# EAGLE design caphumidsens2_rev1_rc1 (EAGLE 6.3)
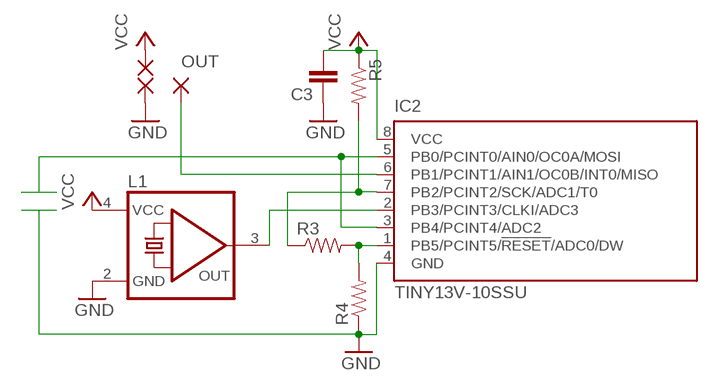
[diagram p0: schematic, sheet 1]

## Parts
C3  CAP0805  [0805]
GND  WIREPADSMD2,54-5,08  SMD2  [SMD1,27-2,54]
IC2  TINY13V-10SSU  [8S1]
L1  XO32-OSCILLATOR  [XO32]
OUT  WIREPADSMD2,54-5,08  SMD2  [SMD1,27-2,54]
R3  RESISTOR0805-RES  [0805]
R4  RESISTOR0805-RES  [0805]
R5  RESISTOR0805-RES  [0805]
VCC  WIREPADSMD2,54-5,08  SMD2  [SMD1,27-2,54]

## Nets
1_3RD_VCC: IC2.1(PB5/PCINT5/!RESET!/ADC0/DW) R3.2 R4.2
2_3RD_VCC: IC2.7(PB2/PCINT2/SCK/ADC1/T0) R3.1 R5.2
CAP+: IC2.3(PB4/PCINT4/ADC2) IC2.5(PB0/PCINT0/AIN0/OC0A/MOSI)
GND: C3.1 GND.1(P) IC2.4(GND) L1.2(GND) R4.1
OSC: IC2.2(PB3/PCINT3/CLKI/ADC3) L1.3(OUT)
OUT: IC2.6(PB1/PCINT1/AIN1/OC0B/INT0/MISO) OUT.1(P)
VCC: C3.2 IC2.8(VCC) L1.4(VCC) R5.1 VCC.1(P)

## Library data of the parts
C3 = SparkFun:CAP: Capacitor Standard 0603 ceramic capacitor, and 0.1" leaded capacitor.
GND OUT VCC = wirepad:SMD2: SMD PAD
IC2 = atmel:TINY13: 8-bit AVR Microcontroller with 1K Bytes In-System Programmable Flash Source: http://www.atmel.com/dyn/resources/prod_documents/2535S.pdf; MPN: ATTINY13V-10SSU; OC_FARNELL: 1455135; OC_NEWARK: 58M3773
L1 = seb:XO32-OSCILLATOR
R3-R5 = SparkFun:RESISTOR: Resistor Basic schematic elements and footprints for 0603, 1206, and PTH resistors.

## Board
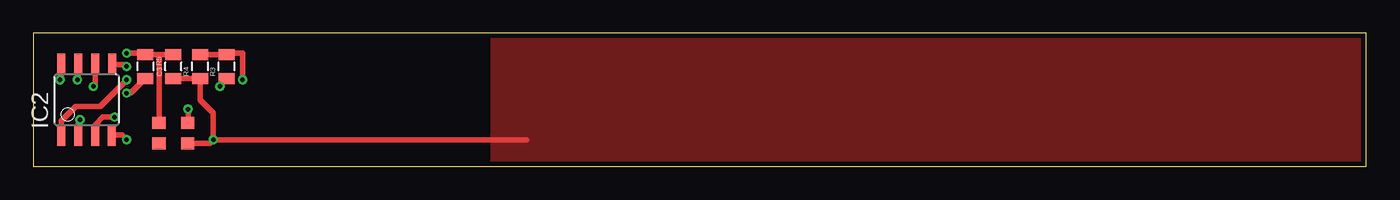
[diagram p1: board, top side]
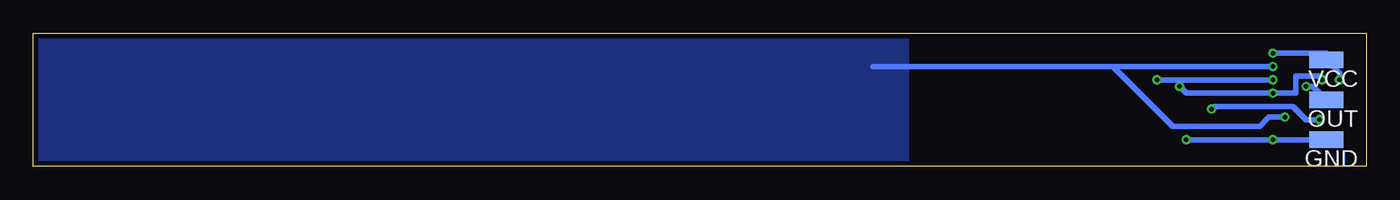
[diagram p2: board, bottom side, seen from below]

Size 100 x 10 mm. Coordinates in mm from the lower left corner, seen from the top.
Outline: 0,0 100,0 100,10 0,10 0,0
Copper layers (1*16): Top 0.0356mm / dielectric 1.5011mm / Bottom 0.0356mm
Design rules "OSHpark": minimum track width 6mil, minimum drill 13mil, track to track 6mil, track to pad 6mil, pad to pad 6mil, via to via 6mil, smd to smd 6mil, copper to edge 15mil, drill to drill 6mil, minimum pad ring 7mil, minimum via ring 7mil, stop-mask expansion 4mil, vias tented up to drill 0mil, thermal gap 10mil

### Footprints (pad centres in the part's own frame; a part is rotated, then mirrored left to right if it is on the bottom)
0805 = smd 0.8 x 1.2: 1 -0.9,0; 2 0.9,0
SMD1,27-2,54 = smd 1.27 x 2.54: 1 0,0
8S1 = smd 0.6 x 1.6: 1 -1.905,-2.654; 2 -0.645,-2.654; 3 0.625,-2.654; 4 1.895,-2.654; 5 1.905,2.654; 6 0.635,2.654; 7 -0.635,2.654; 8 -1.905,2.654
XO32 = smd 1 x 0.9: 1 1.075,0.775; 2 -1.075,0.775; 3 -1.075,-0.775; 4 1.075,-0.775

### Placement (x,y rotation side)
C3  10.5,7.5 90 top
GND  3,2 90 bottom
IC2  4,5 0 top
L1  10.5,2.5 180 top
OUT  3,5 90 bottom
R3  14.5,7.5 90 top
R4  12.5,7.5 90 top
R5  8.4,7.5 270 top
VCC  3,8 90 bottom

### Tracks (layer width: path | path; a pad name or v marks a point on that pad's centre or on a via)
1_3RD_VCC  (via drill 0.33)
  Top 0.406: R4.2 R3.2 14.1,8.5 15.7,8.5 v15.7,6.5 | IC2.1 2.1,3.4 3.19,4.5 5,4.5 v7,6.5
  Bottom 0.406: v15.7,6.5 v7,6.5
2_3RD_VCC  (via drill 0.33)
  Top 0.406: IC2.7 3.37,6.57 v3.3,6.5 | R3.1 v14,6 | R5.2 7.3,5.5 v7,5.5
  Bottom 0.406: v3.3,6.5 3.6,6.8 5.3,6.8 5.3,5.5 v7,5.5 13.5,5.5 v14,6
CAP+  (via drill 0.33)
  Top 0.406: IC2.3 4.62,3.12 5.2,3.7 v6.1,3.7 | IC2.5 6.85,7.65 v7,7.5
  Bottom 0.406: v6.1,3.7 7.3,3.7 8,3 14.5,3 19,7.5 | 19,7.5 19.5,7.5 37,7.5 | v7,7.5 19,7.5
  pour Bottom: 34.5,11 34.5,-1 101,-1 101,11
GND  (via drill 0.33)
  Top 0.406: C3.1 R4.1 12.5,5 13.5,4 v13.5,2 | v13.5,2 37,2 | v13.5,2 13.22,1.73 L1.2 | IC2.4 6.65,2.35 v7,2
  Bottom 0.406: GND.1 v7,2 v13.5,2
  pour Top: 34.5,11 34.5,-1 101,-1 101,11
OSC  (via drill 0.33)
  Top 0.406: IC2.2 3.35,3.35 v3.5,3.5 | v11.6,4.3 11.6,3.3 L1.3
  Bottom 0.406: v3.5,3.5 4.5,3.5 5.5,4.5 11.4,4.5 v11.6,4.3
OUT  (via drill 0.33)
  Top 0.406: IC2.6 4.63,6.13 v4.5,6
  Bottom 0.406: v4.5,6 4,6 OUT.1
VCC  (via drill 0.33)
  Top 0.406: IC2.8 2.1,6.59 v2,6.5 | 9.43,8.4 R5.1 7.9,8.5 v7,8.5 | 9.43,8.4 C3.2 | L1.4 9.43,8.4
  Bottom 0.406: v2,6.5 2,7 VCC.1 3,8.5 v7,8.5